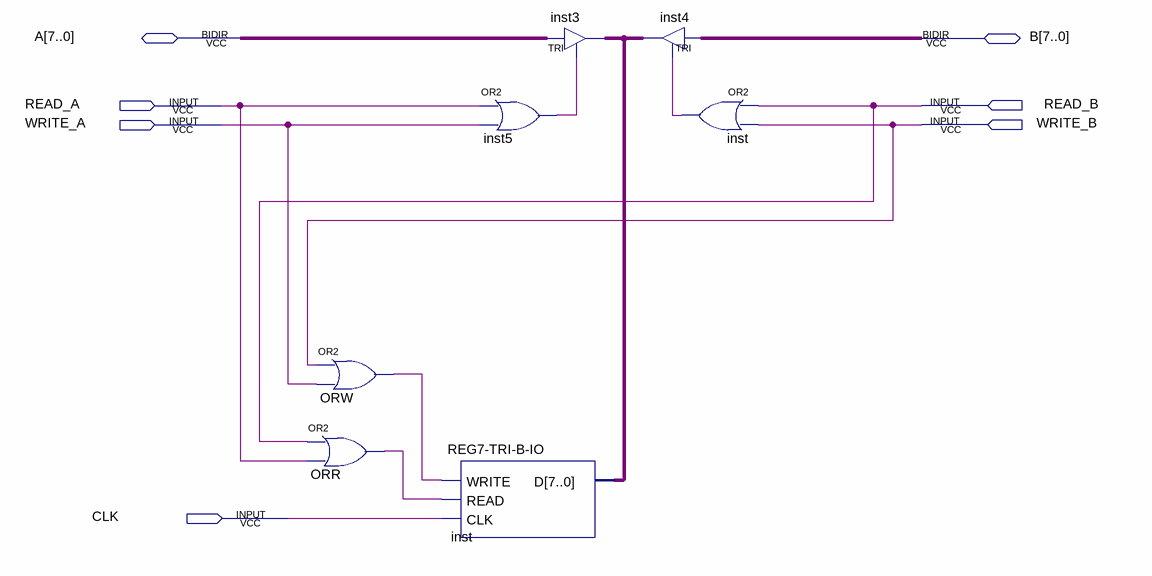
[diagram p0: schematic sheet]
// Quartus schematic Block1.bdf as structural Verilog: 7 symbols, 7 pins
module Block1 (
  input  READ_A,
  input  READ_B,
  input  WRITE_A,
  input  WRITE_B,
  input  CLK,
  inout  [7:0] A,
  inout  [7:0] B
);

  wire inst5_out, inst_out, ORR_out, ORW_out;
  wire [7:0] inst_d;

  or ORR (ORR_out, READ_B, READ_A);
  or ORW (ORW_out, WRITE_B, WRITE_A);
  \REG7-TRI-B-IO  inst (.WRITE(ORW_out), .READ(ORR_out), .CLK(CLK), .D(inst_d));
  or inst5 (inst5_out, READ_A, WRITE_A);
  TRI inst3[7:0] (.IN(A), .OE(inst5_out), .OUT(inst_d));
  TRI inst4[7:0] (.IN(B), .OE(inst_out), .OUT(inst_d));
  or inst_dup2 (inst_out, READ_B, WRITE_B);
endmodule
